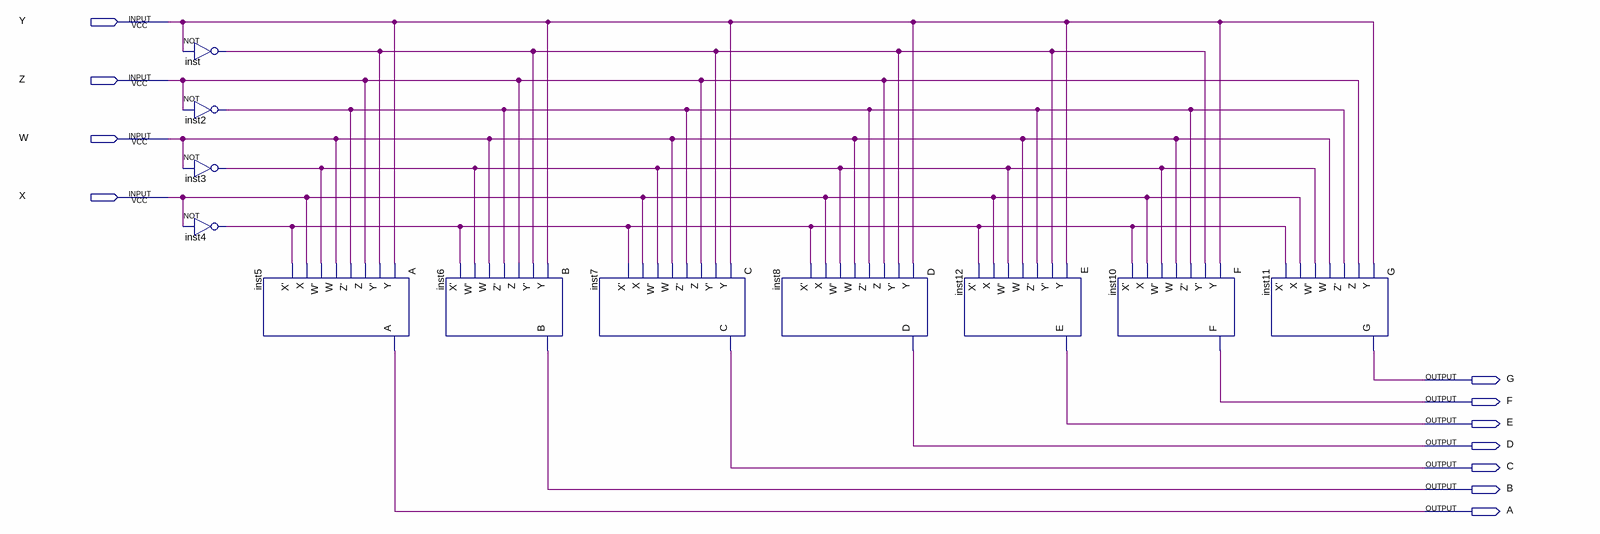
[diagram p0: schematic sheet]
// Quartus schematic main.bdf as structural Verilog: 11 symbols, 11 pins
module main (
  input  Y,
  input  Z,
  input  W,
  input  X,
  output G,
  output F,
  output E,
  output D,
  output C,
  output B,
  output A
);

  wire inst2_out, inst3_out, inst4_out, inst_out;

  not inst (inst_out, Y);
  not inst2 (inst2_out, Z);
  not inst3 (inst3_out, W);
  not inst4 (inst4_out, X);
  A inst5 (.Y(Y), .\Y' (inst_out), .Z(Z), .\Z' (inst2_out), .W(W), .\W' (inst3_out), .X(X), .\X' (inst4_out), .A(A));
  B inst6 (.Y(Y), .\Y' (inst_out), .Z(Z), .\Z' (inst2_out), .W(W), .\W' (inst3_out), .\X' (inst4_out), .B(B));
  C inst7 (.Y(Y), .\Y' (inst_out), .Z(Z), .\Z' (inst2_out), .W(W), .\W' (inst3_out), .X(X), .\X' (inst4_out), .C(C));
  D inst8 (.Y(Y), .\Y' (inst_out), .Z(Z), .\Z' (inst2_out), .W(W), .\W' (inst3_out), .X(X), .\X' (inst4_out), .D(D));
  E inst12 (.Y(Y), .\Y' (inst_out), .\Z' (inst2_out), .W(W), .\W' (inst3_out), .X(X), .\X' (inst4_out), .E(E));
  F inst10 (.Y(Y), .\Y' (inst_out), .\Z' (inst2_out), .W(W), .\W' (inst3_out), .X(X), .\X' (inst4_out), .F(F));
  G inst11 (.Y(Y), .Z(Z), .\Z' (inst2_out), .W(W), .\W' (inst3_out), .X(X), .\X' (inst4_out), .G(G));
endmodule
